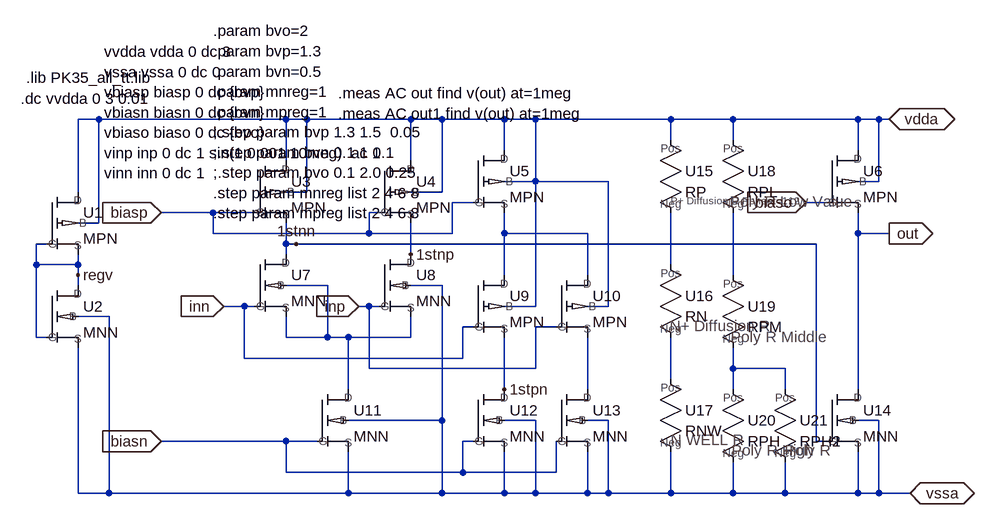
[diagram p0: schematic amp.asc]
amp.asc, the LTspice schematic file:
Version 4
SHEET 1 1188 680
WIRE -208 -128 -240 -128
WIRE 80 -128 -208 -128
WIRE 112 -128 80 -128
WIRE 272 -128 112 -128
WIRE 320 -128 272 -128
WIRE 416 -128 320 -128
WIRE 464 -128 416 -128
WIRE 672 -128 464 -128
WIRE 768 -128 672 -128
WIRE 960 -128 768 -128
WIRE 992 -128 960 -128
WIRE 1008 -128 992 -128
WIRE 672 -96 672 -128
WIRE 768 -96 768 -128
WIRE 416 -80 416 -128
WIRE 960 -80 960 -128
WIRE 80 -64 80 -128
WIRE 272 -64 272 -128
WIRE 464 -32 464 -128
WIRE 464 -32 416 -32
WIRE 576 -32 464 -32
WIRE 992 -32 992 -128
WIRE 992 -32 960 -32
WIRE -240 -16 -240 -128
WIRE 112 -16 112 -128
WIRE 112 -16 80 -16
WIRE 320 -16 320 -128
WIRE 320 -16 272 -16
WIRE 368 0 336 0
WIRE 912 0 880 0
WIRE -32 16 -112 16
WIRE 32 16 -32 16
WIRE 224 16 208 16
WIRE -208 32 -208 -128
WIRE -208 32 -240 32
WIRE -32 48 -32 16
WIRE 208 48 208 16
WIRE 208 48 -32 48
WIRE 336 48 336 0
WIRE 336 48 208 48
WIRE 416 48 416 16
WIRE 544 48 416 48
WIRE 960 48 960 16
WIRE 1008 48 960 48
WIRE -288 64 -304 64
WIRE 80 64 80 32
WIRE 96 64 80 64
WIRE 896 64 96 64
WIRE 80 80 80 64
WIRE 272 80 272 32
WIRE -304 96 -304 64
WIRE -240 96 -240 80
WIRE -240 96 -304 96
WIRE 672 96 672 16
WIRE -240 112 -240 96
WIRE 416 112 416 48
WIRE 544 112 544 48
WIRE 768 112 768 16
WIRE -240 128 -240 112
WIRE 144 128 80 128
WIRE 320 128 272 128
WIRE 16 160 -16 160
WIRE 32 160 16 160
WIRE 208 160 192 160
WIRE 224 160 208 160
WIRE 464 160 464 -32
WIRE 464 160 416 160
WIRE 576 160 576 -32
WIRE 576 160 544 160
WIRE -192 176 -240 176
WIRE 368 192 352 192
WIRE 496 192 464 192
WIRE -304 208 -304 96
WIRE -288 208 -304 208
WIRE 80 208 80 176
WIRE 144 208 144 128
WIRE 144 208 80 208
WIRE 176 208 144 208
WIRE 272 208 272 176
WIRE 272 208 176 208
WIRE 16 240 16 160
WIRE 352 240 352 192
WIRE 352 240 16 240
WIRE 208 256 208 160
WIRE 464 256 464 192
WIRE 464 256 208 256
WIRE 768 256 768 224
WIRE 848 256 768 256
WIRE 672 272 672 208
WIRE 176 288 176 208
WIRE 416 288 416 208
WIRE 544 288 544 208
WIRE 768 288 768 256
WIRE 848 288 848 256
WIRE 960 288 960 48
WIRE 320 336 320 128
WIRE 320 336 176 336
WIRE 464 336 416 336
WIRE 576 336 544 336
WIRE 992 336 960 336
WIRE 80 368 -112 368
WIRE 128 368 80 368
WIRE 368 368 352 368
WIRE 896 368 896 64
WIRE 912 368 896 368
WIRE 80 416 80 368
WIRE 352 416 352 368
WIRE 352 416 80 416
WIRE 496 416 496 368
WIRE 496 416 352 416
WIRE -240 448 -240 224
WIRE -192 448 -192 176
WIRE -192 448 -240 448
WIRE 176 448 176 384
WIRE 176 448 -192 448
WIRE 320 448 320 336
WIRE 320 448 176 448
WIRE 416 448 416 384
WIRE 416 448 320 448
WIRE 464 448 464 336
WIRE 464 448 416 448
WIRE 544 448 544 384
WIRE 544 448 464 448
WIRE 576 448 576 336
WIRE 576 448 544 448
WIRE 672 448 672 384
WIRE 672 448 576 448
WIRE 768 448 768 400
WIRE 768 448 672 448
WIRE 848 448 848 400
WIRE 848 448 768 448
WIRE 960 448 960 384
WIRE 960 448 848 448
WIRE 992 448 992 336
WIRE 992 448 960 448
WIRE 1040 448 992 448
FLAG 1008 -128 vdda
IOPIN 1008 -128 BiDir
FLAG 1040 448 vssa
IOPIN 1040 448 BiDir
FLAG -112 16 biasp
IOPIN -112 16 In
FLAG 1008 48 out
IOPIN 1008 48 Out
FLAG -112 368 biasn
IOPIN -112 368 In
FLAG -16 160 inn
IOPIN -16 160 In
FLAG 192 160 inp
IOPIN 192 160 In
FLAG 880 0 biaso
IOPIN 880 0 In
FLAG 96 64 1stnn
FLAG 272 80 1stnp
FLAG 416 288 1stpn
FLAG -240 112 regv
SYMBOL MPN -256 32 R0
SYMATTR InstName U1
SYMATTR SpiceLine l=1u w=4u pd=w*l*1e6 ps=pd ad=w/100 as=ad m={mpreg}
SYMBOL MPN 64 -16 R0
SYMATTR InstName U3
SYMBOL MPN 256 -16 R0
SYMATTR InstName U4
SYMBOL MPN 400 -32 R0
SYMATTR InstName U5
SYMBOL MPN 944 -32 R0
SYMATTR InstName U6
SYMATTR SpiceLine l=1u w=4u pd=w*l*1e6 ps=pd ad=w/100 as=ad m={mpreg}
SYMBOL MPN 400 160 R0
SYMATTR InstName U9
SYMBOL MPN 528 160 R0
SYMATTR InstName U10
SYMBOL MNN -256 176 R0
SYMATTR InstName U2
SYMATTR SpiceLine l=1u w=4u pd=w*l*1e6 ps=pd ad=w/100 as=ad m={mnreg}
SYMBOL MNN 64 128 R0
SYMATTR InstName U7
SYMATTR SpiceLine l=1u w=4u pd=w*l*1e6 ps=pd ad=w/100 as=ad m=10
SYMBOL MNN 256 128 R0
SYMATTR InstName U8
SYMATTR SpiceLine l=1u w=4u pd=w*l*1e6 ps=pd ad=w/100 as=ad m=10
SYMBOL MNN 160 336 R0
SYMATTR InstName U11
SYMATTR SpiceLine l=1u w=4u pd=w*l*1e6 ps=pd ad=w/100 as=ad m=20
SYMBOL MNN 400 336 R0
SYMATTR InstName U12
SYMBOL MNN 528 336 R0
SYMATTR InstName U13
SYMBOL MNN 944 336 R0
SYMATTR InstName U14
SYMATTR SpiceLine l=1u w=4u pd=w*l*1e6 ps=pd ad=w/100 as=ad m={mnreg}
SYMBOL RP 672 -48 R0
SYMATTR InstName U15
SYMATTR SpiceLine *L=100u W=10u
SYMBOL RN 672 144 R0
SYMATTR InstName U16
SYMBOL RNW 672 320 R0
SYMATTR InstName U17
SYMBOL RPL 768 -48 R0
SYMATTR InstName U18
SYMATTR SpiceLine l=100u w=10u
SYMBOL RPM 768 160 R0
SYMATTR InstName U19
SYMBOL RPH 768 336 R0
SYMATTR InstName U20
SYMATTR SpiceLine l=100u w=10u
SYMBOL RPH2 848 336 R0
SYMATTR InstName U21
SYMATTR SpiceLine l=100u W=10u
TEXT -200 -232 Left 2 !vvdda vdda 0 dc 3\nvssa vssa 0 dc 0\nvbiasp biasp 0 dc {bvp}\nvbiasn biasn 0 dc {bvn}\nvbiaso biaso 0 dc {bvo}\nvinp inp 0 dc 1 sin(1 0.001 10meg)  ac 1\nvinn inn 0 dc 1
TEXT -328 -160 Left 2 !.dc vvdda 0 3 0.01
TEXT -32 -264 Left 2 !.param bvo=2\n.param bvp=1.3\n.param bvn=0.5\n.param mnreg=1\n.param mpreg=1\n;.step param bvp 1.3 1.5  0.05\n;.step param bvn 0.1 1 0.1\n;.step param bvo 0.1 2.0 0.25\n.step param mnreg list 2 4 6 8\n.step param mpreg list 2 4 6 8
TEXT 160 -168 Left 2 !.meas AC out find v(out) at=1meg\n.meas AC out1 find v(out) at=1meg
TEXT -320 -192 Left 2 !.lib PK35_all_tt.lib

The netlist it stands for:
* amp.asc
XU1 vdda regv regv vdda MPN l=1u w=4u pd=w*l*1e6 ps=pd ad=w/100 as=ad m={mpreg}  ; pins D G S B
XU3 vdda biasp 1stnn vdda MPN l=1u w=4u pd=w+l+l ps=pd ad=w*l as=ad m=1  ; pins D G S B
XU4 vdda biasp 1stnp vdda MPN l=1u w=4u pd=w+l+l ps=pd ad=w*l as=ad m=1  ; pins D G S B
XU5 vdda biasp N001 vdda MPN l=1u w=4u pd=w+l+l ps=pd ad=w*l as=ad m=1  ; pins D G S B
XU6 vdda biaso out vdda MPN l=1u w=4u pd=w*l*1e6 ps=pd ad=w/100 as=ad m={mpreg}  ; pins D G S B
XU9 N001 inn 1stpn vdda MPN l=1u w=4u pd=w+l+l ps=pd ad=w*l as=ad m=1  ; pins D G S B
XU10 N001 inp N007 vdda MPN l=1u w=4u pd=w+l+l ps=pd ad=w*l as=ad m=1  ; pins D G S B
XU2 regv regv vssa vssa MNN l=1u w=4u pd=w*l*1e6 ps=pd ad=w/100 as=ad m={mnreg}  ; pins D G S B
XU7 1stnn inn N004 N004 MNN l=1u w=4u pd=w*l*1e6 ps=pd ad=w/100 as=ad m=10  ; pins D G S B
XU8 1stnp inp N004 vssa MNN l=1u w=4u pd=w*l*1e6 ps=pd ad=w/100 as=ad m=10  ; pins D G S B
XU11 N004 biasn vssa vssa MNN l=1u w=4u pd=w*l*1e6 ps=pd ad=w/100 as=ad m=20  ; pins D G S B
XU12 1stpn biasn vssa vssa MNN l=1u w=4u pd=w+l+l ps=pd ad=w*l as=ad m=1  ; pins D G S B
XU13 N007 biasn vssa vssa MNN l=1u w=4u pd=w+l+l ps=pd ad=w*l as=ad m=1  ; pins D G S B
XU14 out 1stnn vssa vssa MNN l=1u w=4u pd=w*l*1e6 ps=pd ad=w/100 as=ad m={mnreg}  ; pins D G S B
XU15 vdda N002 RP *L=100u W=10u  ; pins Pos Neg
XU16 N002 N006 RN L=100u W=10u  ; pins Pos Neg
XU17 N006 vssa RNW L=100u W=10u  ; pins Pos Neg
XU18 vdda N003 RPL l=100u w=10u  ; pins Pos Neg
XU19 N003 N005 RPM L=100u W=10u  ; pins Pos Neg
XU20 N005 vssa RPH l=100u w=10u  ; pins Pos Neg
XU21 N005 vssa RPH2 l=100u W=10u  ; pins Pos Neg
vvdda vdda 0 dc 3
vssa vssa 0 dc 0
vbiasp biasp 0 dc {bvp}
vbiasn biasn 0 dc {bvn}
vbiaso biaso 0 dc {bvo}
vinp inp 0 dc 1 sin(1 0.001 10meg)  ac 1
vinn inn 0 dc 1
.dc vvdda 0 3 0.01
.param bvo=2
.param bvp=1.3
.param bvn=0.5
.param mnreg=1
.param mpreg=1
;.step param bvp 1.3 1.5  0.05
;.step param bvn 0.1 1 0.1
;.step param bvo 0.1 2.0 0.25
.step param mnreg list 2 4 6 8
.step param mpreg list 2 4 6 8
.meas AC out find v(out) at=1meg
.meas AC out1 find v(out) at=1meg
.lib PK35_all_tt.lib
.backanno
.end